# EAGLE design R3D2_main (EAGLE 5.06)
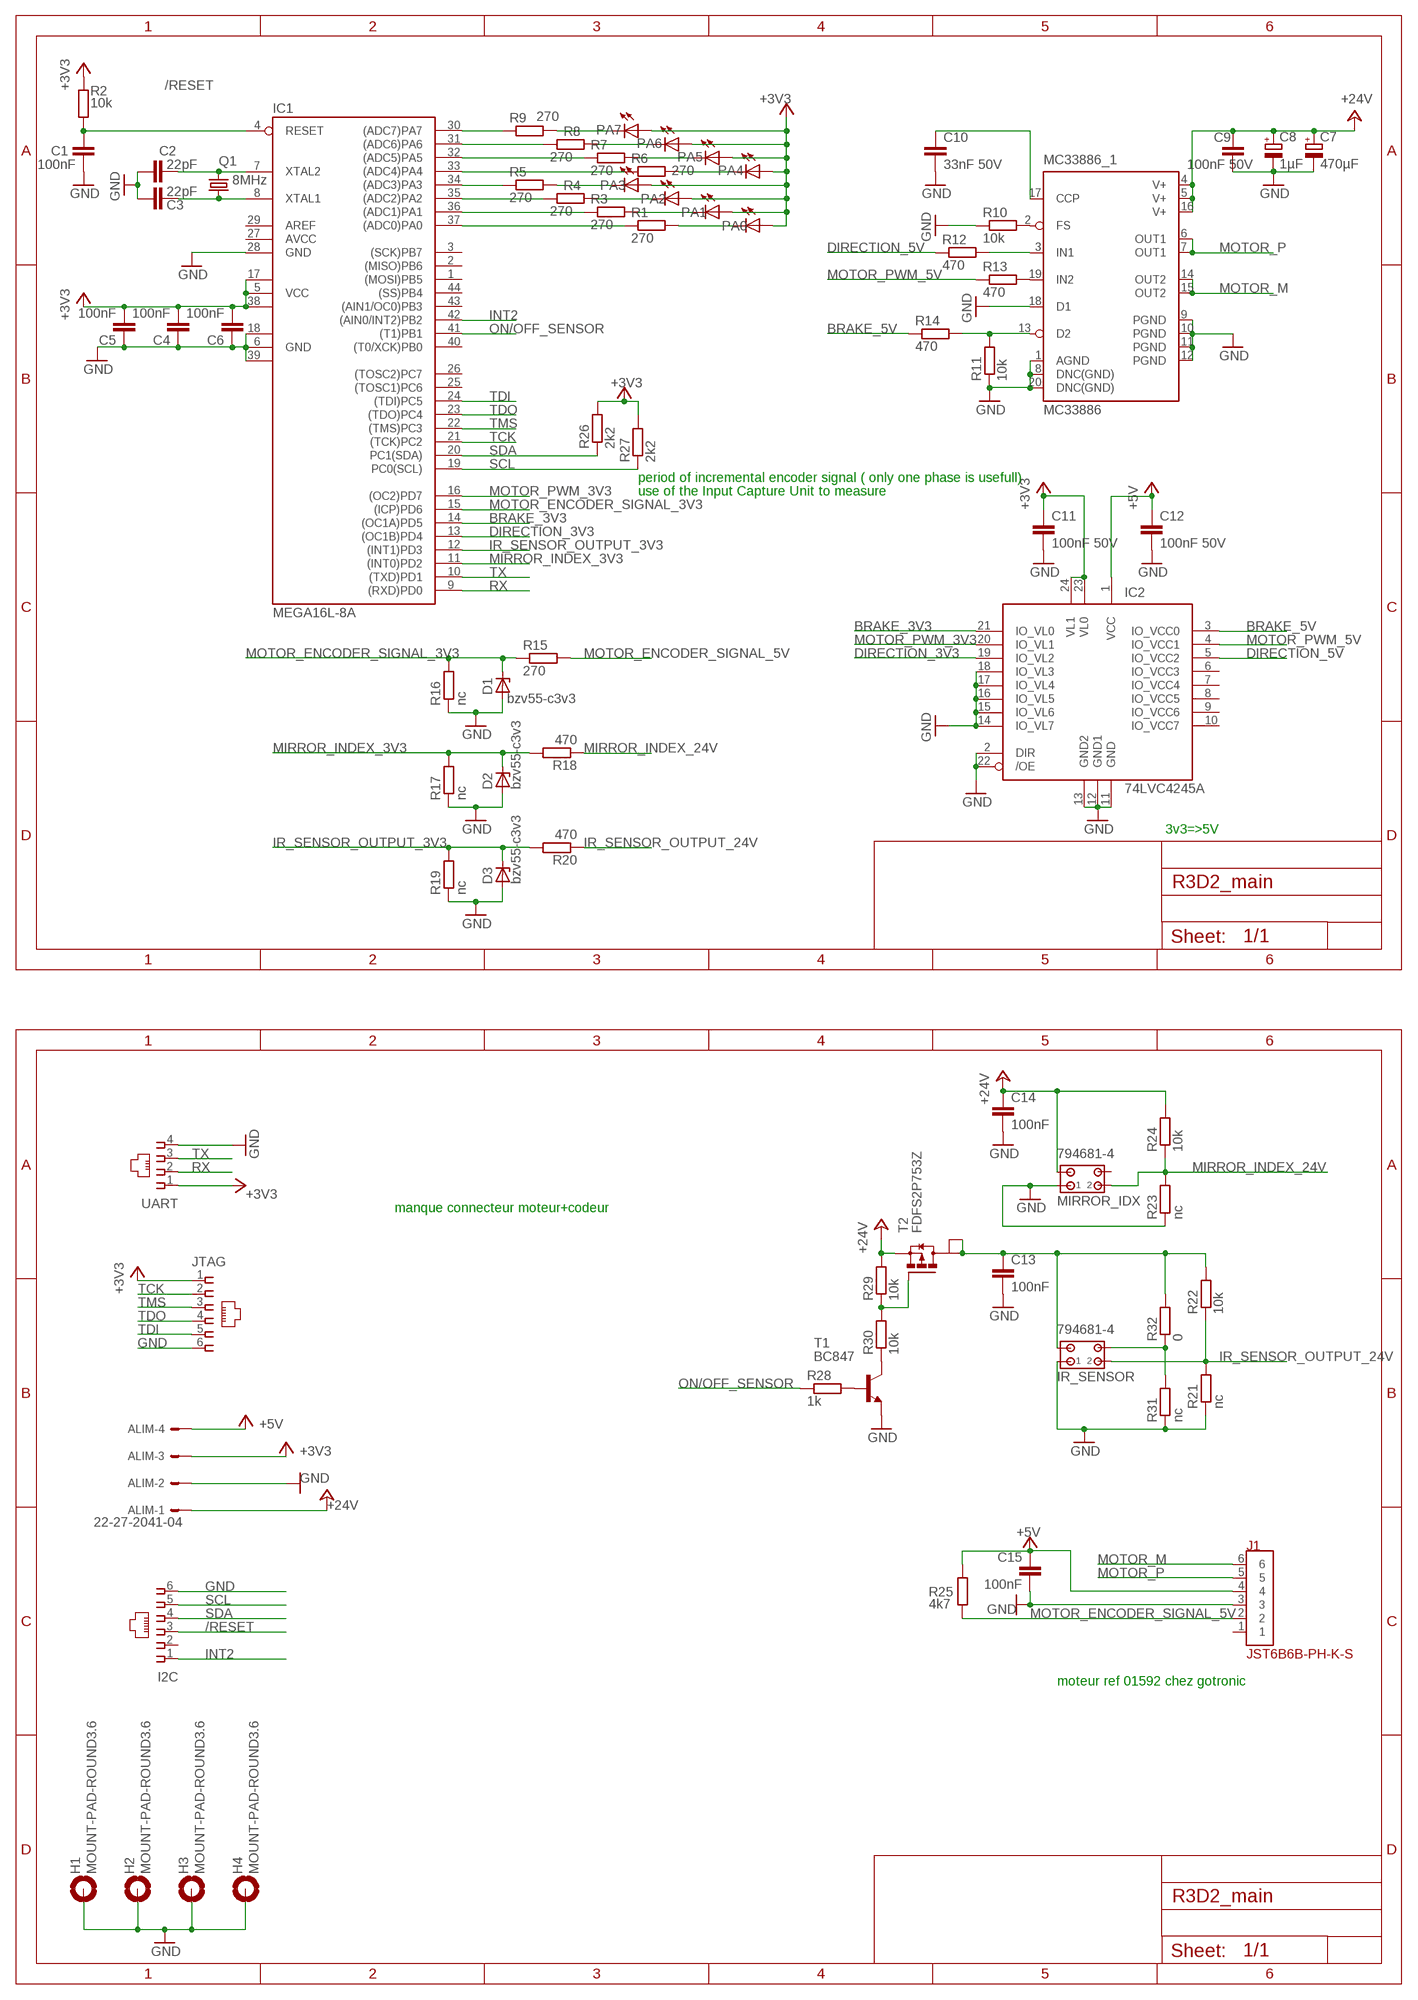
[diagram p0: schematic, sheet 1]

## Parts
ALIM  22-27-2041-04  [6410-04]
C1  100nF  C-EU050-025X075  [C050-025X075]
C2  22pF  C-EUC0805  [C0805]
C3  22pF  C-EUC0805  [C0805]
C4  100nF  C-EUC0805  [C0805]
C5  100nF  C-EUC0805  [C0805]
C6  100nF  C-EUC0805  [C0805]
C7  470µF  CPOL-EUE30-16AXIAL  [E30-16]
C8  1µF  CPOL-EUE5-5  [E5-5]
C9  100nF 50V  C-EUC0805  [C0805]
C10  33nF 50V  C-EUC0805  [C0805]
C11  100nF 50V  C-EUC0805  [C0805]
C12  100nF 50V  C-EUC0805  [C0805]
C13  100nF  C-EUC0805  [C0805]
C14  100nF  C-EUC0805  [C0805]
C15  100nF  C-EUC0805  [C0805]
D1  bzv55-c3v3  ZENER-DIODESOD80C  [SOD80C]
D2  bzv55-c3v3  ZENER-DIODESOD80C  [SOD80C]
D3  bzv55-c3v3  ZENER-DIODESOD80C  [SOD80C]
H1  MOUNT-PAD-ROUND3.6  [3,6-PAD]
H2  MOUNT-PAD-ROUND3.6  [3,6-PAD]
H3  MOUNT-PAD-ROUND3.6  [3,6-PAD]
H4  MOUNT-PAD-ROUND3.6  [3,6-PAD]
I2C  520258-3  [520258-3]
IC1  MEGA16L-8A  MEGA16-A  [TQFP44]
IC2  74LVC4245A  [TSSOP24]
IR_SENSOR  794681-4  [794681-4]
J1  JST6B6B-PH-K-S  [B6B-PH-K-S]
JTAG  520250-3  [520250-3]
MC33886_1  MC33886  [20HSOP]
MIRROR_IDX  794681-4  [794681-4]
PA0  LEDCHIP-LED0805  [CHIP-LED0805]
PA1  LEDCHIP-LED0805  [CHIP-LED0805]
PA2  LEDCHIP-LED0805  [CHIP-LED0805]
PA3  LEDCHIP-LED0805  [CHIP-LED0805]
PA4  LEDCHIP-LED0805  [CHIP-LED0805]
PA5  LEDCHIP-LED0805  [CHIP-LED0805]
PA6  LEDCHIP-LED0805  [CHIP-LED0805]
PA7  LEDCHIP-LED0805  [CHIP-LED0805]
Q1  8MHz  CRYSTALHC49S  [HC49/S]
R1  270  R-EU_R0805  [R0805]
R2  10k  R-EU_R0805  [R0805]
R3  270  R-EU_R0805  [R0805]
R4  270  R-EU_R0805  [R0805]
R5  270  R-EU_R0805  [R0805]
R6  270  R-EU_R0805  [R0805]
R7  270  R-EU_R0805  [R0805]
R8  270  R-EU_R0805  [R0805]
R9  270  R-EU_R0805  [R0805]
R10  10k  R-EU_M0805  [M0805]
R11  10k  R-EU_R0805  [R0805]
R12  470  R-EU_R0805  [R0805]
R13  470  R-EU_R0805  [R0805]
R14  470  R-EU_R0805  [R0805]
R15  270  R-EU_R0805  [R0805]
R16  nc  R-EU_R0805  [R0805]
R17  nc  R-EU_R0805  [R0805]
R18  470  R-EU_R0805  [R0805]
R19  nc  R-EU_R0805  [R0805]
R20  470  R-EU_R0805  [R0805]
R21  nc  R-EU_R0805  [R0805]
R22  10k  R-EU_R0805  [R0805]
R23  nc  R-EU_R0805  [R0805]
R24  10k  R-EU_R0805  [R0805]
R25  4k7  R-EU_R0805  [R0805]
R26  2k2  R-EU_R0805  [R0805]
R27  2k2  R-EU_R0805  [R0805]
R28  1k  R-EU_R0805  [R0805]
R29  10k  R-EU_R0805  [R0805]
R30  10k  R-EU_R0805  [R0805]
R31  nc  R-EU_R0805  [R0805]
R32  0  R-EU_R0805  [R0805]
T1  BC847  [SOT23]
T2  FDFS2P753Z  [SO8]
UART  555165-2  [555165-2]

## Nets
+3V3: ALIM.3 C4.2 C5.2 C6.2 C11.1 IC1.5(VCC) IC1.17(VCC1) IC1.38(VCC2) IC2.23(VL0) IC2.24(VL1) JTAG.1 PA0.A PA1.A PA2.A PA3.A PA4.A PA5.A PA6.A PA7.A R2.2 R26.2 R27.2 UART.1
+5V: ALIM.4 C12.1 C15.1 IC2.1(VCC) J1.4 R25.2
+24V: ALIM.1 C7.+ C8.+ C9.1 C14.1 MC33886_1.4(V+) MC33886_1.5(V+) MC33886_1.16(V+) MIRROR_IDX.3 R24.2 R29.2 T2.3(S)
/RESET: C1.1 I2C.3 IC1.4(RESET) R2.1
BRAKE_3V3: IC1.14((OC1A)PD5) IC2.21(IO_VL0)
BRAKE_5V: IC2.3(IO_VCC0) R14.1
DIRECTION_3V3: IC1.13((OC1B)PD4) IC2.19(IO_VL2)
DIRECTION_5V: IC2.5(IO_VCC2) R12.1
GND: ALIM.2 C1.2 C2.1 C3.1 C4.1 C5.1 C6.1 C7.- C8.- C9.2 C10.2 C11.2 C12.2 C13.2 C14.2 C15.2 D1.A D2.A D3.A H1.B3,6(MOUNT) H2.B3,6(MOUNT) H3.B3,6(MOUNT) H4.B3,6(MOUNT) I2C.6 IC1.6(GND) IC1.18(GND1) IC1.28(GND) IC1.39(GND2) IC2.2(DIR) IC2.11(GND) IC2.12(GND1) IC2.13(GND2) IC2.14(IO_VL7) IC2.15(IO_VL6) IC2.16(IO_VL5) IC2.17(IO_VL4) IC2.18(IO_VL3) IC2.22(/OE) IR_SENSOR.1 J1.3 JTAG.6 MC33886_1.1(AGND) MC33886_1.8(DNC(GND)) MC33886_1.9(PGND) MC33886_1.10(PGND) MC33886_1.11(PGND) MC33886_1.12(PGND) MC33886_1.18(D1) MC33886_1.20(DNC(GND)) MIRROR_IDX.1 R10.1 R11.1 R16.1 R17.1 R19.1 R21.1 R23.1 R31.1 T1.2(E) UART.4
INT2: I2C.1 IC1.42((AIN0/INT2)PB2)
IR_SENSOR_OUTPUT_3V3: D3.C IC1.12((INT1)PD3) R19.2 R20.2
IR_SENSOR_OUTPUT_24V: IR_SENSOR.2 R20.1 R21.2 R22.1
MIRROR_INDEX_3V3: D2.C IC1.11((INT0)PD2) R17.2 R18.2
MIRROR_INDEX_24V: MIRROR_IDX.2 R18.1 R23.2 R24.1
MOTOR_ENCODER_SIGNAL_3V3: D1.C IC1.15((ICP)PD6) R15.1 R16.2
MOTOR_ENCODER_SIGNAL_5V: J1.2 R15.2 R25.1
MOTOR_M: J1.6 MC33886_1.14(OUT2) MC33886_1.15(OUT2)
MOTOR_P: J1.5 MC33886_1.6(OUT1) MC33886_1.7(OUT1)
MOTOR_PWM_3V3: IC1.16((OC2)PD7) IC2.20(IO_VL1)
MOTOR_PWM_5V: IC2.4(IO_VCC1) R13.1
N$1: C2.2 IC1.7(XTAL2) Q1.2
N$2: C3.2 IC1.8(XTAL1) Q1.1
N$3: PA0.C R1.2
N$4: PA7.C R9.2
N$5: PA2.C R4.2
N$6: PA1.C R3.2
N$7: IC1.30((ADC7)PA7) R9.1
N$8: IC1.31((ADC6)PA6) R8.1
N$9: PA3.C R5.2
N$10: IC1.32((ADC5)PA5) R7.1
N$11: PA4.C R6.2
N$12: IC1.33((ADC4)PA4) R6.1
N$13: PA5.C R7.2
N$14: IC1.34((ADC3)PA3) R5.1
N$15: PA6.C R8.2
N$16: IC1.35((ADC2)PA2) R4.1
N$17: IC1.36((ADC1)PA1) R3.1
N$18: IC1.37((ADC0)PA0) R1.1
N$19: C10.1 MC33886_1.17(CCP)
N$20: C13.1 IR_SENSOR.3 R22.2 R32.2 T2.5(D) T2.6(D1)
N$21: IR_SENSOR.4 R31.2 R32.1
N$22: MC33886_1.13(D2) R11.2 R14.2
N$23: MC33886_1.19(IN2) R13.2
N$24: MC33886_1.3(IN1) R12.2
N$26: MC33886_1.2(FS) R10.2
N$27: R28.2 T1.1(B)
N$28: R30.1 T1.3(C)
N$29: R29.1 R30.2 T2.4(G)
ON/OFF_SENSOR: IC1.41((T1)PB1) R28.1
RX: IC1.9((RXD)PD0) UART.2
SCL: I2C.5 IC1.19(PC0(SCL)) R27.1
SDA: I2C.4 IC1.20(PC1(SDA)) R26.1
TCK: IC1.21((TCK)PC2) JTAG.2
TDI: IC1.24((TDI)PC5) JTAG.5
TDO: IC1.23((TDO)PC4) JTAG.4
TMS: IC1.22((TMS)PC3) JTAG.3
TX: IC1.10((TXD)PD1) UART.3
Unconnected: I2C.2 IC1.1((MOSI)PB5) IC1.2((MISO)PB6) IC1.3((SCK)PB7) IC1.25((TOSC1)PC6) IC1.26((TOSC2)PC7) IC1.29(AREF) IC1.40((T0/XCK)PB0) IC1.43((AIN1/OC0)PB3) IC1.44((SS)PB4) IC2.6(IO_VCC3) IC2.7(IO_VCC4) IC2.8(IO_VCC5) IC2.9(IO_VCC6) IC2.10(IO_VCC7) J1.1 MIRROR_IDX.4

## Notes on the sheet
- period of incremental encoder signal ( only one phase is usefull)
- use of the Input Capture Unit to measure
- 3v3=>5V
- manque connecteur moteur+codeur
- moteur ref 01592 chez gotronic

## Power pins joined to a net without a drawn wire
AVCC: IC1.27(AVCC)

## Library data of the parts
ALIM = con-molex:22-?-04: CONNECTOR wire to board 2.54 mm (.1 inch) pitch header
C1-C6 C9-C15 = rcl:C-EU: CAPACITOR, European symbol
C7 C8 = rcl:CPOL-EU: POLARIZED CAPACITOR, European symbol
D1-D3 = diode:ZENER-DIODE: Z-Diode
H1-H4 = holes:MOUNT-PAD-ROUND: MOUNTING PAD, round
I2C = con-amp:520258-3: AMP connector
IC1 = atmel:MEGA16: MICROCONTROLLER 16 Kbytes FLASH 1 kbytes SRAM 512 bytes EEPROM USART 8-channel 10 bit ADC Source: avr.lbr
IC2 = robotter:74LVC4245: octal transceiver buffer
IR_SENSOR MIRROR_IDX = con-amp:794681-4: Micro MATE-N-LOK Connectors grid 1.5mm Dual Row Through Hole Vertical Metal Through Hole Holddowns Source: ENG_CD_794681_E.pdf
J1 = robotter:JST6
JTAG = con-amp:520250-3: AMP connector
MC33886_1 = MC33886:MC33886: freescale H bridge 5A MC33886
PA0 PA1-PA7 = led:LED: LED OSRAM: - CHIPLED LG R971, LG N971, LY N971, LG Q971, LY Q971, LO R971, LY R971 LH N974, LH R974 LS Q976, LO Q976, LY Q976 LO Q996 - Hyper CHIPLED LW Q18S LB Q993, LB Q99A, LB R99A - SideLED LS A670, LO A670, LY A670, LG A670, LP A670 LB A673, LV A673, LT A673, LW A673 LH A674 LY A675 LS A676, LA A676, LO A676, LY A676, LW A676 LS A679, LY A679, LG A679 - Hyper Micro SIDELED® LS Y876, LA Y876, LO Y876, LY Y876 LT Y87S - SmartLED LW L88C, LW L88S LB L89C, LB L89S, LG L890 LS L89K, LO L89K, LY L89K LS L896, LA L896, LO L896, LY L896 - TOPLED LS T670, LO T670, LY T670, LG T670, LP T670 LSG T670, LSP T670, LSY T670, LOP T670, LYG T670 LG T671, LOG T671, LSG T671 LB T673, LV T673, LT T673, LW T673 LH T674 LS T676, LA T676, LO T676, LY T676, LB T676, LH T676, LSB T676, LW T676 LB T67C, LV T67C, LT T67C, LS T67K, LO T67K, LY T67K, LW E67C LS E67B, LA E67B, LO E67B, LY E67B, LB E67C, LV E67C, LT E67C LW T67C LS T679, LY T679, LG T679 LS T770, LO T770, LY T770, LG T770, LP T770 LB T773, LV T773, LT T773, LW T773 LH T774 LS E675, LA E675, LY E675, LS T675 LS T776, LA T776, LO T776, LY T776, LB T776 LHGB T686 LT T68C, LB T68C - Hyper Mini TOPLED® LB M676 - Mini TOPLED Santana® LG M470 LS M47K, LO M47K, LY M47K Source: http://www.osram.convergy.de LUXEON: - LUMILED® LXK2-PW12-R00, LXK2-PW12-S00, LXK2-PW14-U00, LXK2-PW14-V00 LXK2-PM12-R00, LXK2-PM12-S00, LXK2-PM14-U00 LXK2-PE12-Q00, LXK2-PE12-R00, LXK2-PE12-S00, LXK2-PE14-T00, LXK2-PE14-U00 LXK2-PB12-K00, LXK2-PB12-L00, LXK2-PB12-M00, LXK2-PB14-N00, LXK2-PB14-P00, LXK2-PB14-Q00 LXK2-PR12-L00, LXK2-PR12-M00, LXK2-PR14-Q00, LXK2-PR14-R00 LXK2-PD12-Q00, LXK2-PD12-R00, LXK2-PD12-S00 LXK2-PH12-R00, LXK2-PH12-S00 LXK2-PL12-P00, LXK2-PL12-Q00, LXK2-PL12-R00 Source: www.luxeon.com KINGBRIGHT: KA-3528ASYC Source: www.kingbright.com
Q1 = crystal:CRYSTAL: CRYSTAL
R1-R32 = rcl:R-EU_: RESISTOR, European symbol
T1 = transistor:BC847: NPN TRANSISTOR
T2 = robotter:FDFS2P753Z
UART = con-amp:555165-2: AMP connector

## Board
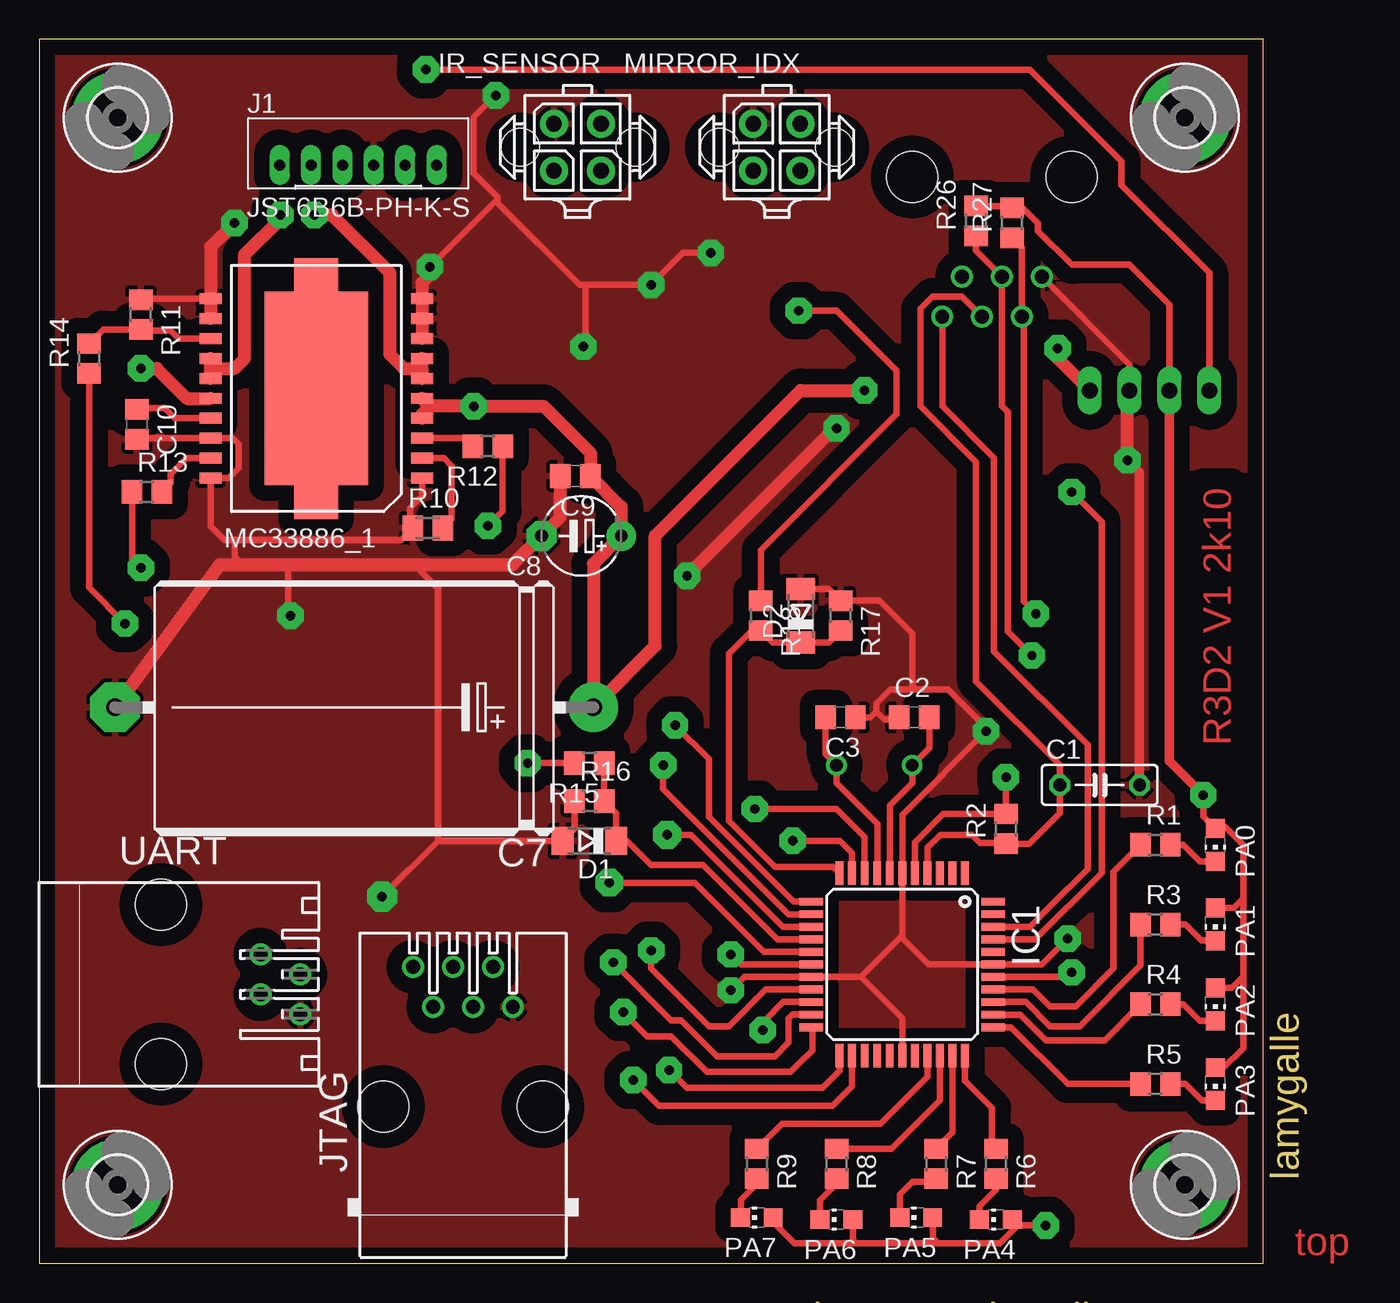
[diagram p1: board, top side]
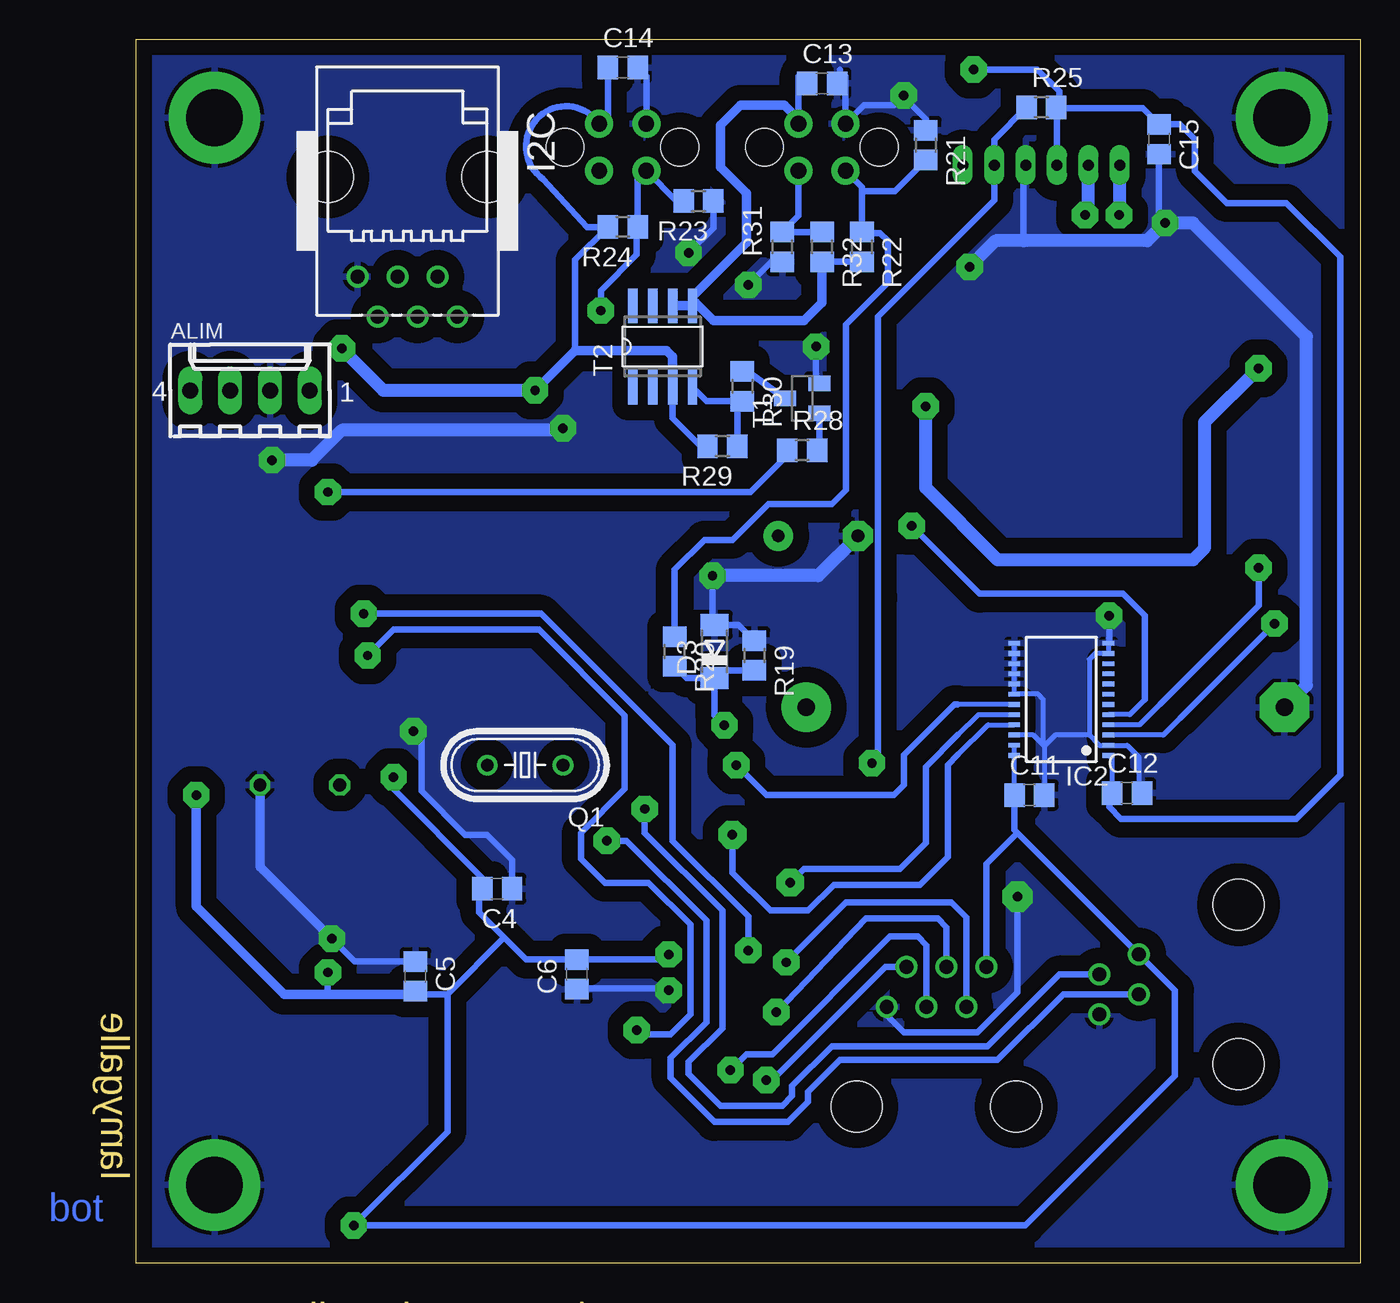
[diagram p2: board, bottom side, seen from below]

Size 78 x 78 mm. Coordinates in mm from the lower left corner, seen from the top.
Outline: 0,0 78,0 78,78 0,78 0,0
Copper layers (1*16): Top 0.035mm / dielectric 1.5mm / Bottom 0.035mm
Design rules "default *": minimum track width 0.3mm, minimum drill 0.4mm, track to track 1mm, track to pad 1mm, pad to pad 1mm, via to via 0.3mm, smd to smd 8mil, copper to edge 1mm, drill to drill 8mil, minimum pad ring 10mil, minimum via ring 8mil, stop-mask expansion 4mil, vias tented up to drill 0mil, thermal gap 10mil

### Footprints (pad centres in the part's own frame; a part is rotated, then mirrored left to right if it is on the bottom)
6410-04 = drill 1.016 long: 1 3.81,0; 2 1.27,0; 3 -1.27,0; 4 -3.81,0
C050-025X075 = drill 0.813 octagon: 1 -2.54,0; 2 2.54,0
C0805 = smd 1.3 x 1.5: 1 -0.95,0; 2 0.95,0
E30-16 = drill 1.118 pad 3.15 round: + -15.24,0 | drill 1.118 pad 3.15 octagon: - 15.24,0
E5-5 = drill 0.813 pad 1.905 round: + -2.54,0 | drill 0.813 pad 1.905 octagon: - 2.54,0
SOD80C = smd 1.4 x 1.8: A 1.7,0; C -1.7,0
3,6-PAD = drill 3.6 pad 5.842 round: B3,6 0,0
520258-3 = drill 0.889 round: 1 -3.175,8.001; 2 -1.905,5.461; 3 -0.635,8.001; 4 0.635,5.461; 5 1.905,8.001; 6 3.175,5.461 | hole 3.251: -5.08,-0.889; 5.08,-0.889
TQFP44 = smd 1.5 x 0.5: 1 -5.8,4; 2 -5.8,3.2; 3 -5.8,2.4; 4 -5.8,1.6; 5 -5.8,0.8; 6 -5.8,0; 7 -5.8,-0.8; 8 -5.8,-1.6; 9 -5.8,-2.4; 10 -5.8,-3.2; 11 -5.8,-4; 23 5.8,-4; 24 5.8,-3.2; 25 5.8,-2.4; 26 5.8,-1.6; 27 5.8,-0.8; 28 5.8,0; 29 5.8,0.8; 30 5.8,1.6; 31 5.8,2.4; 32 5.8,3.2; 33 5.8,4 | smd 0.5 x 1.5: 12 -4,-5.8; 13 -3.2,-5.8; 14 -2.4,-5.8; 15 -1.6,-5.8; 16 -0.8,-5.8; 17 0,-5.8; 18 0.8,-5.8; 19 1.6,-5.8; 20 2.4,-5.8; 21 3.2,-5.8; 22 4,-5.8; 34 4,5.8; 35 3.2,5.8; 36 2.4,5.8; 37 1.6,5.8; 38 0.8,5.8; 39 0,5.8; 40 -0.8,5.8; 41 -1.6,5.8; 42 -2.4,5.8; 43 -3.2,5.8; 44 -4,5.8
TSSOP24 = smd 0.3 x 0.75: 1 -3.575,-3; 2 -2.925,-3; 3 -2.275,-3; 4 -1.625,-3; 5 -0.975,-3; 6 -0.325,-3; 7 0.325,-3; 8 0.975,-3; 9 1.625,-3; 10 2.275,-3; 11 2.925,-3; 12 3.575,-3; 13 3.575,3; 14 2.925,3; 15 2.275,3; 16 1.625,3; 17 0.975,3; 18 0.325,3; 19 -0.325,3; 20 -0.975,3; 21 -1.625,3; 22 -2.275,3; 23 -2.925,3; 24 -3.575,3
794681-4 = drill 1 pad 1.778 round: 1 1.5,-1.5; 2 1.5,1.5; 3 -1.5,-1.5; 4 -1.5,1.5 | hole 2.4: 3.63,0; -3.67,0
B6B-PH-K-S = drill 0.7 pad 1.27 long: 1 5,0; 2 3,0; 3 1,0; 4 -1,0; 5 -3,0; 6 -5,0
520250-3 = drill 0.889 round: 1 -3.175,8.89; 2 -1.905,6.35; 3 -0.635,8.89; 4 0.635,6.35; 5 1.905,8.89; 6 3.175,6.35 | hole 3.251: -5.08,0; 5.08,0
20HSOP = smd 0.7 x 1.4: 1 -5.715,-6.731; 2 -4.445,-6.731; 3 -3.175,-6.731; 4 -1.905,-6.731; 5 -0.635,-6.731; 6 0.635,-6.731; 7 1.905,-6.731; 8 3.175,-6.731; 9 4.445,-6.731; 10 5.715,-6.731; 11 5.715,6.731; 12 4.445,6.731; 13 3.175,6.731; 14 1.905,6.731; 15 0.635,6.731; 16 -0.635,6.731; 17 -1.905,6.731; 18 -3.175,6.731; 19 -4.445,6.731; 20 -5.715,6.731 | smd 12.35 x 6.6: SL1 0,0 | smd 2.15 x 2.8: SL2 -7.239,0; SL3 7.239,0
CHIP-LED0805 = smd 1.2 x 1.2: A 0,-1.05; C 0,1.05
HC49/S = drill 0.813 round: 1 -2.413,0; 2 2.413,0
R0805 = smd 1.3 x 1.5: 1 -0.95,0; 2 0.95,0
M0805 = smd 1.3 x 1.6: 1 -0.95,0; 2 0.95,0
SOT23 = smd 1 x 1.4: 1 -0.95,-1.1; 2 0.95,-1.1; 3 0,1.1
SO8 = smd 0.6 x 2.2: 1 -1.905,-2.6; 2 -0.635,-2.6; 3 0.635,-2.6; 4 1.905,-2.6; 5 1.905,2.6; 6 0.635,2.6; 7 -0.635,2.6; 8 -1.905,2.6
555165-2 = drill 0.889 round: 1 -1.905,5.207; 2 -0.635,7.747; 3 0.635,5.207; 4 1.905,7.747 | hole 3.251: -5.08,-1.143; 5.08,-1.143

### Placement (x,y rotation side)
ALIM  70.74,55.63 0 bottom
C1  67.56,30.48 0 top
C2  55.75,34.8 0 top
C3  51.05,34.8 180 top
C4  54.99,23.88 180 bottom
C5  60.2,18.29 270 bottom
C6  49.91,18.41 90 bottom
C7  20.07,35.43 180 top
C8  34.54,46.35 180 top
C9  34.16,50.16 180 top
C10  6.22,53.47 270 top
C11  21.08,29.84 0 bottom
C12  14.86,29.97 0 bottom
C13  34.29,75.18 0 bottom
C14  46.99,76.2 0 bottom
C15  12.83,71.63 270 bottom
D1  35.05,26.92 180 top
D2  48.51,41.27 90 top
D3  41.15,38.99 90 bottom
H1  73,5 0 top
H2  73,73 0 top
H3  5,73 0 top
H4  5,5 0 top
I2C  60.71,68.33 180 bottom
IC1  54.99,19.05 270 top
IC2  19.05,35.94 90 bottom
IR_SENSOR  34.29,71.12 180 top
J1  20.32,69.98 0 top
JTAG  27,10 0 top
MC33886_1  17.65,55.75 90 top
MIRROR_IDX  46.99,71.12 180 top
PA0  74.93,26.67 180 top
PA1  74.93,21.59 180 top
PA2  74.93,16.51 180 top
PA3  74.93,11.43 180 top
PA4  60.96,2.79 90 top
PA5  55.88,2.92 90 top
PA6  50.8,2.79 90 top
PA7  45.72,2.92 90 top
Q1  53.21,31.75 180 bottom
R1  71.12,26.67 0 top
R2  61.59,27.69 90 top
R3  71.12,21.59 0 top
R4  71.12,16.51 0 top
R5  71.12,11.43 0 top
R6  60.96,6.35 270 top
R7  57.15,6.35 270 top
R8  50.8,6.35 270 top
R9  45.72,6.35 270 top
R10  24.77,46.86 0 top
R11  6.48,60.45 270 top
R12  28.57,52.07 180 top
R13  6.86,49.15 0 top
R14  3.17,57.66 90 top
R15  35.05,31.88 180 top
R16  35.05,29.46 0 top
R17  51.05,41.27 270 top
R18  45.97,41.27 270 top
R19  38.61,38.73 270 bottom
R20  43.69,38.99 270 bottom
R21  27.69,71.25 270 bottom
R22  31.75,64.77 270 bottom
R23  42.16,67.69 180 bottom
R24  46.99,66.04 180 bottom
R25  20.32,73.66 0 bottom
R26  59.69,66.42 90 top
R27  61.98,66.29 90 top
R28  35.56,51.82 0 bottom
R29  40.64,52.07 180 bottom
R30  39.37,55.88 270 bottom
R31  36.83,64.77 90 bottom
R32  34.29,64.77 270 bottom
T1  35.56,55.12 90 bottom
T2  44.45,58.42 0 bottom
UART  8.89,17.78 270 top

### Tracks (layer width: path | path; a pad name or v marks a point on that pad's centre or on a via)
+3V3  (via drill 0.6 pad 1.68)
  Top 0.406: IC1.38 65.49,18.25 v65.79,18.54 | v64.14,2.41 62.36,2.41 | 62.36,2.41 62.14,2.41 PA4.A | ALIM.3 72.01,61.09 69.47,63.63 65.79,63.63 63.63,65.79 63.63,66.29 62.61,67.31 62.04,67.31 R27.2 62.36,67.37 R26.2 | v61.59,30.99 R2.2 57.59,28.64 55.79,26.84 IC1.5 | PA7.A 46.77,2.63 48.13,1.27 52.07,1.27 | 57.28,1.27 61.21,1.27 62.36,2.41 | 57.28,1.27 52.07,1.27 | PA5.A 56.93,1.62 57.28,1.27 | PA6.A 51.85,1.49 52.07,1.27 | 76.71,23.24 76.71,18.29 | 76.71,18.29 76.71,13.72 75.44,12.45 74.96,12.45 PA3.A | PA2.A 75.98,17.56 76.71,18.29 | PA1.A 76.11,22.64 76.71,23.24 | v74.17,29.84 74.17,28.48 PA0.A 75.02,27.81 75.56,27.81 76.71,26.67 76.71,23.24 | IC1.17 44.7,19.05 v44.07,19.68
  Top 0.61: v74.17,29.84 72.01,32 ALIM.3
  Bottom 0.305: IC2.23 IC2.24 22.05,30.37 C11.1
  Bottom 0.406: 54.55,20.77 53.15,19.36 C6.2 44.39,19.36 v44.07,19.68 | 54.55,20.77 56.13,22.35 56.13,23.68 C4.2 55.94,24.57 61.59,30.23 v61.59,30.99 | 58.17,17.14 60.39,17.14 | 58.17,17.14 54.55,20.77 | v65.79,18.54 65.79,17.27 65.66,17.14 | 58.17,17.14 58.17,8.38 v64.14,2.41 21.34,2.41 11.81,11.94 11.81,17.4 UART.1 21.84,27.43 | 21.84,27.43 22.03,27.62 C11.1 | JTAG.1 23.82,25.45 21.84,27.43
  Bottom 0.61: C5.2 60.39,17.14 65.66,17.14 68.58,17.14 74.17,22.73 v74.17,29.84
+5V  (via drill 0.6 pad 1.68)
  Top 0.406: ALIM.4 74.55,63.12 68.96,68.71 68.96,70.23 63.12,76.07 61.72,76.07 | v24.64,76.07 61.72,76.07 | 61.72,76.07 62.74,76.07
  Bottom 0.305: C12.1 15.81,32.12 IC2.1
  Bottom 0.406: 19.32,73.61 R25.2 19.18,73.85 19.18,74.68 20.57,76.07 v24.64,76.07 | 19.32,73.61 13.86,73.61 C15.1 11.49,72.58 10.54,71.63 10.54,69.6 8.51,67.56 4.7,67.56 1.27,64.14 1.27,63.25 | 1.27,31.5 1.27,31.37 | 1.27,31.5 1.27,63.25 | 1.27,63.25 1.27,63.63 | C12.1 16,29.78 16,29.08 15.24,28.32 4.06,28.32 1.27,31.11 1.27,31.5 | 19.32,73.61 J1.4
+24V  (via drill 0.6 pad 1.68)
  Top 0.813: 24.89,54.61 MC33886_1.5 | 24.89,54.61 v27.69,54.61 32.13,54.61 35.11,51.63 C9.1 37.08,48.19 C8.+ 35.31,44.58 C7.+ 39.24,39.37 39.24,46.35 48.51,55.63 v52.58,55.63 | 24.89,54.61 24.38,54.1 MC33886_1.4 | MC33886_1.16 9.4,55.12 7.49,57.02 v6.48,57.02 | v64.9,58.29 64.9,57.66 ALIM.1
  Bottom 0.406: C14.1 47.94,73.17 MIRROR_IDX.3 arc-200 52.07,69.09 49.28,66.04 R24.2 50.04,63.94 50.04,58.17 | R29.2 42.04,52.07 43.81,53.85 T2.3
  Bottom 0.61: T2.3 43.81,57.78 44.2,58.17 50.04,58.17 v52.58,55.63
  Bottom 0.813: v6.48,57.02 9.91,53.59 9.91,45.59 10.67,44.83 23.11,44.83 27.69,49.4 v27.69,54.61 | v52.58,55.63 62.23,55.63 v64.9,58.29
/RESET
  Top 0.406: C1.1 64.83,30.23 | I2C.3 58.8,61.59 56.9,61.59 56.13,60.83 56.13,54.61 59.69,51.05 59.69,37.08 65.02,31.75 C1.1 | C1.1 65.02,28.7 63.06,26.74 R2.1 61.53,26.8 59.94,26.8 59.44,27.3 57.4,27.3 56.59,26.49 IC1.4
BRAKE_3V3  (via drill 0.6 pad 1.78)
  Top 0.406: IC1.14 47.38,21.45 41.85,26.99 | 41.85,26.99 41.66,27.18 | v40.01,27.3 41.53,27.3 41.85,26.99
  Bottom 0.305: IC2.21 23.72,34.32 25.65,32.38
  Bottom 0.406: 25.65,32.38 26.29,31.75 26.29,25.91 28.07,24.13 33.53,24.13 35.18,22.48 37.59,22.48 40.01,24.89 v40.01,27.3
BRAKE_5V  (via drill 0.6 pad 1.68)
  Top 0.406: R14.1 3.17,43.05 v5.46,40.77
  Bottom 0.305: IC2.3 12.56,33.67 11.43,34.8
  Bottom 0.406: 11.43,34.8 v5.46,40.77
DIRECTION_3V3  (via drill 0.6 pad 1.68)
  Top 0.406: IC1.13 47.73,22.25 39.75,30.23 v39.75,31.75
  Bottom 0.305: IC2.19 25.65,35.62
  Bottom 0.406: 25.65,35.62 25.85,35.62 29.08,32.38 29.08,30.48 29.72,29.84 37.85,29.84 v39.75,31.75
DIRECTION_5V  (via drill 0.6 pad 1.68)
  Top 0.406: R12.1 29.52,47.94 v28.57,46.99
  Bottom 0.305: IC2.5 14.69,34.97 13.72,35.94
  Bottom 0.406: v28.57,46.99 24.26,42.67 15.11,42.67 13.72,41.27 13.72,35.94
GND  (via drill 0.6 pad 1.68, 0.6 pad 1.93)
  Top 0.406: 55.88,36.58 57.91,36.58 60.33,34.16 v60.33,33.91 54.99,28.57 IC1.6 54.99,20.88 54.9,20.79 | 55.88,36.58 54.23,36.58 53.34,35.69 53.34,35.18 | 53.34,35.18 53.85,34.67 54.68,34.67 C2.1 | C3.1 52.96,34.8 53.34,35.18 | MC33886_1.11 6.54,61.47 R11.1 | C10.2 6.28,52.58 MC33886_1.18 12.32,52.58 12.7,52.2 12.7,50.67 12.06,50.04 MC33886_1.20 10.92,46.99 11.81,46.1 12.45,46.1 | 52.36,18.25 IC1.18 44.92,18.25 v44.07,17.4 | D2.A 50.3,42.98 R17.1 53.53,42.23 55.63,40.13 55.63,36.83 55.88,36.58 | v65.53,20.7 63.88,19.05 IC1.39 56.64,19.05 54.9,20.79 | ALIM.2 69.47,57.28 I2C.6 | MC33886_1.1 24.38,48.9 23.62,48.13 23.62,47.06 R10.1 23.05,46.1 12.45,46.1 | 12.95,44.52 12.45,45.02 12.45,46.1 | v16,41.27 15.88,41.4 15.88,44.52 | v24.89,63.5 29.08,67.69 29.15,67.63 | 29.15,67.63 34.42,62.36 34.8,62.36 | 34.8,62.36 v38.99,62.36 40.51,63.88 | v34.67,58.42 34.8,58.04 34.8,62.36 | v29.08,74.42 27.69,73.03 27.69,69.47 29.21,67.94 29.21,67.69 29.15,67.63 | 40.51,63.88 40.77,64.14 | v42.8,64.39 41.02,64.39 40.51,63.88 | R16.1 34.1,27.67 D1.A 25.4,26.92 | 54.9,20.79 52.36,18.25 | 52.36,18.25 54.99,15.62 IC1.28 | 25.4,26.92 v21.84,23.37 | 25.4,26.92 25.4,42.99 23.88,44.52
  Top 0.61: C1.2 70.1,50.42 v69.34,51.18
  Top 0.813: MC33886_1.8 MC33886_1.9 MC33886_1.10 24.38,62.48 25.15,63.25 v24.89,63.5 | MC33886_1.12 MC33886_1.11 10.92,64.77 v12.45,66.29 | 15.62,44.52 12.95,44.52 11.5,44.52 C7.- | 15.62,44.52 15.88,44.52 | v69.34,51.18 69.34,55.5 ALIM.2 | v50.8,53.21 50.67,53.21 v41.27,43.81 | 23.88,44.52 24.06,44.52 | 15.62,44.52 23.88,44.52 | 23.88,44.52 30.16,44.52 C8.- 33.21,47.56 C9.2
  Bottom 0.305: C12.2 14.1,30.67 14.1,32.26 14.86,33.02 IC2.2 16.63,33.02 17.27,33.66 | IC2.12 IC2.11 16.89,38.86 17.27,38.48 17.27,33.66 | 20.13,32.96 C11.2 | 20.13,32.96 20.26,33.08 | 20.26,33.08 20.83,33.66 22.04,33.66 IC2.22 | IC2.13 IC2.14 IC2.15 IC2.16 IC2.17 IC2.18 20.52,36.27 20.19,35.94 20.19,33.15 20.26,33.08 | 17.27,33.66 19.44,33.66 20.13,32.96
  Bottom 0.406: C15.2 12.83,66.67 v12.45,66.29 | 21.46,65.15 21.46,69.71 | C14.2 45.49,75.65 MIRROR_IDX.1 | 49.85,17.53 C6.1 | 49.85,17.53 48.13,17.53 | C5.1 64.07,19.24 v65.53,20.7 | IC2.12 16,39.56 v16,41.27 | 33.15,76.07 33.15,75.63 C13.2 32.79,75.65 IR_SENSOR.1 31.62,73.79 29.72,73.79 29.21,74.3 | v29.08,74.42 29.21,74.3 | v38.99,62.36 37.53,63.82 R31.1 | T1.2 34.67,56.28 v34.67,58.42 | 29.21,74.3 29.08,74.3 27.69,72.9 R21.1 | v42.8,64.39 41.21,65.97 R23.1 | C4.1 54.04,25.72 55.63,27.3 57.02,27.3 59.82,30.1 59.82,33.4 v60.33,33.91 | 49.85,17.53 44.7,17.53 v44.07,17.4 | R19.1 39.61,40.69 D3.A 41.27,40.69 v41.27,43.81 | JTAG.6 30.18,15.82 29.08,14.73 24.38,14.73 21.84,17.27 v21.84,23.37
  Bottom 0.61: v65.53,20.7 70.1,25.27 C1.2
  Bottom 0.813: v24.89,63.5 23.24,65.15 21.46,65.15 13.59,65.15 v12.45,66.29 10.67,66.29 3.43,59.05 3.43,36.83 C7.- | v50.8,53.21 50.93,53.09 64.9,53.09 66.8,51.18 v69.34,51.18 | v41.27,43.81 34.54,43.81 C8.-
  pour Top: 0,78.11 77.98,78.11 77.98,0 0,0
  pour Bottom: 0,-0.13 77.98,-0.13 77.98,77.85 0,77.85
INT2
  Top 0.406: IC1.42 63.11,21.45 64.39,22.73 | 64.39,22.73 64.64,22.99 | 64.39,22.73 66.8,25.15 66.8,33.02 60.83,38.99 60.83,51.31 57.53,54.61 I2C.1
IR_SENSOR_OUTPUT_3V3  (via drill 0.6 pad 1.68)
  Top 0.406: IC1.12 48.07,23.05 42.67,28.45 42.67,32.13 v40.51,34.29
  Bottom 0.406: R19.2 40.65,37.78 D3.C | D3.C 41.15,34.92 v40.51,34.29 | R20.2 42.94,37.29 D3.C
IR_SENSOR_OUTPUT_24V
  Bottom 0.406: IR_SENSOR.2 31.75,68.58 31.75,68.33 | 31.75,68.33 R22.1 31.69,65.66 30.61,65.66 30.1,65.15 30.1,62.48 32.77,59.82 32.77,49.28 33.66,48.39 37.72,48.39 40.01,46.1 41.78,46.1 43.69,44.2 43.69,41.91 R20.1 | R21.2 29.66,68.33 31.75,68.33
MIRROR_INDEX_3V3
  Top 0.406: R17.2 50.3,39.58 D2.C 46.72,39.58 R18.2 45.41,40.33 43.94,38.86 43.94,28.19 46.86,25.27 50.57,25.27 IC1.11
MIRROR_INDEX_24V  (via drill 0.6 pad 1.68)
  Top 0.406: R18.1 45.97,45.47 54.61,54.1 54.61,56.9 50.8,60.71 v48.39,60.71
  Bottom 0.406: v48.39,60.71 48.39,61.98 46.1,64.26 46.1,65.98 R24.1 46.04,69.07 MIRROR_IDX.2 43.56,67.69 R23.2
MOTOR_ENCODER_SIGNAL_3V3
  Top 0.406: R15.1 R16.2 36.75,28.71 D1.C 37.47,26.92 38.99,25.4 42.29,25.4 47.04,20.65 IC1.15
MOTOR_ENCODER_SIGNAL_5V  (via drill 0.6 pad 1.68)
  Top 0.406: v31.11,31.88 R15.2
  Bottom 0.406: R25.1 23.32,71.61 J1.2 23.32,67.74 30.73,60.33 30.73,42.67 | 30.73,42.67 30.73,42.16 | 30.73,42.67 30.73,32.26 v31.11,31.88
MOTOR_M  (via drill 0.6 pad 1.68)
  Top 0.813: MC33886_1.15 10.92,57.02 | 10.92,57.02 MC33886_1.14 | 10.92,57.02 12.45,57.02 13.08,57.66 13.08,64.26 15.37,66.55 v15.37,66.8
  Bottom 0.813: v15.37,66.8 15.32,66.85 J1.6
MOTOR_P  (via drill 0.6 pad 1.68)
  Top 0.813: 24.38,57.02 MC33886_1.7 | 24.38,57.02 MC33886_1.6 | 24.38,57.02 23.24,57.02 22.35,57.91 22.35,63.12 18.67,66.8 v17.53,66.8
  Bottom 0.813: v17.53,66.8 17.32,67.01 J1.5
MOTOR_PWM_3V3  (via drill 0.6 pad 1.78)
  Top 0.406: v36.32,24.26 41.78,24.26 46.19,19.85 IC1.16
  Bottom 0.305: IC2.20 24.34,34.97 25.65,33.66
  Bottom 0.406: 25.65,33.66 27.69,31.62 27.69,26.8 29.34,25.15 35.43,25.15 v36.32,24.26
MOTOR_PWM_5V  (via drill 0.6 pad 1.68)
  Top 0.406: R13.1 5.91,44.89 v6.48,44.32
  Bottom 0.305: IC2.4 14.07,34.32 12.7,35.69
  Bottom 0.406: 12.7,35.69 6.48,41.91 v6.48,44.32
N$1
  Top 0.406: C2.2 56.7,32.83 Q1.2 55.63,30.61 54.19,29.17 IC1.7
N$2
  Top 0.406: C3.2 50.1,32.45 Q1.1 50.8,30.61 53.39,28.02 IC1.8
N$3
  Top 0.406: PA0.C 73.95,25.62 72.9,26.67 R1.2
N$4
  Top 0.406: R9.2 45.72,5.08 44.7,4.06 44.7,2.57 PA7.C
N$5
  Top 0.406: PA2.C 73.95,15.46 72.9,16.51 R4.2
N$6
  Top 0.406: R3.2 73.03,21.59 74.04,20.57 74.9,20.57 PA1.C
N$7
  Top 0.406: R9.1 47.31,8.89 53.59,8.89 56.59,11.89 IC1.30
N$8
  Top 0.406: R8.1 51.69,7.3 | 51.69,7.3 52.89,7.3 | IC1.31 57.39,10.4 54.29,7.3 51.69,7.3
N$9
  Top 0.406: PA3.C 74.08,10.38 73.03,11.43 R5.2
N$10
  Top 0.406: IC1.32 58.19,8.34 R7.1
N$11
  Top 0.406: PA4.C 59.91,3.65 60.96,4.7 R6.2
N$12
  Top 0.406: R6.1 60.71,7.55 60.71,9.91 58.99,11.62 IC1.33
N$13
  Top 0.406: PA5.C 54.83,4.41 55.63,5.21 56.96,5.21 R7.2
N$14
  Top 0.406: IC1.34 61.91,15.05 65.53,11.43 R5.1
N$15
  Top 0.406: R8.2 50.8,5.08 49.75,4.03 PA6.C
N$16
  Top 0.406: IC1.35 62.51,15.85 64.14,14.22 67.88,14.22 R4.1
N$17
  Top 0.406: 69.85,21.59 R3.1 70.17,18.99 66.29,15.11 64.39,15.11 62.85,16.65 IC1.36
N$18
  Top 0.406: R1.1 68.45,24.95 68.45,18.8 66.04,16.38 64.39,16.38 63.32,17.45 IC1.37
N$19
  Top 0.406: MC33886_1.17 8.64,53.85 8,54.48 6.29,54.48 C10.1
N$20
  Bottom 0.406: IR_SENSOR.3 35.79,75.65 C13.1 | R32.2 R22.2
  Bottom 0.61: T2.5 T2.6 | T2.5 42.35,61.21 41.21,60.07 35.43,60.07 34.29,61.21 R32.2 | T2.5 42.55,61.59 39.12,65.02 39.12,68.2 40.77,69.85 40.77,72.52 39.5,73.79 36.7,73.79 35.79,72.87 IR_SENSOR.3
N$21
  Bottom 0.406: R32.1 R31.2 35.79,66.76 IR_SENSOR.4
N$22
  Top 0.406: MC33886_1.13 8.89,58.93 8.38,59.44 6.54,59.44 R11.2 4.07,59.5 R14.2
N$23
  Top 0.406: MC33886_1.19 9.4,51.31 8.38,50.29 8.38,49.72 R13.2
N$24
  Top 0.406: MC33886_1.3 27.12,52.58 R12.2
N$26
  Top 0.406: R10.2 26.29,47.44 26.29,50.8 25.78,51.31 MC33886_1.2
N$27
  Bottom 0.406: R28.2 34.46,51.97 T1.1
N$28
  Bottom 0.406: T1.3 39.22,56.98 R30.1
N$29
  Bottom 0.406: R29.1 39.69,54.61 R30.2 41.66,54.93 T2.4
ON/OFF_SENSOR  (via drill 0.6 pad 1.68)
  Top 0.406: IC1.41 63.45,20.65 67.69,24.89 67.69,47.24 v65.79,49.15
  Bottom 0.406: R28.1 36.51,51.5 38.86,49.15 v65.79,49.15
RX  (via drill 0.6 pad 1.68)
  Top 0.406: v45.59,28.96 50.8,28.96 52.59,27.16 IC1.9
  Bottom 0.406: UART.2 19.18,18.41 23.75,13.84 33.66,13.84 36.2,11.3 36.2,10.67 36.83,10.03 40.77,10.03 42.8,12.06 42.8,12.83 40.64,14.99 40.64,22.48 45.59,27.43 v45.59,28.96
SCL  (via drill 0.6 pad 1.68)
  Top 0.406: IC1.19 46.28,17.45 43.94,15.11 42.67,15.11 38.99,18.8 v38.99,19.94 38.99,19.81 | v63.5,41.4 62.74,42.16 62.74,60.2 I2C.5 62.61,64.71 R27.1
  Bottom 0.406: v63.5,41.4 52.2,41.4 43.81,33.02 43.81,26.92 38.99,22.1 v38.99,19.94
SDA  (via drill 0.6 pad 1.68)
  Top 0.406: 46.23,14.99 v46.1,14.86 46.23,14.86 46.23,15.49 47.38,16.65 IC1.20 | R26.1 59.69,64.52 I2C.4 61.34,54.61 61.72,54.23 61.72,40.26 v63.25,38.73
  Bottom 0.406: v63.25,38.73 61.59,40.39 52.32,40.39 46.86,34.92 46.86,30.23 49.66,27.43 49.66,25.78 48.13,24.26 45.34,24.26 42.67,21.59 42.67,15.88 43.94,14.61 45.34,14.61 v46.1,14.86
TCK  (via drill 0.6 pad 1.68)
  Top 0.406: IC1.21 49.17,15.88 48.01,15.88 47.75,15.62 47.75,14.1 46.86,13.21 43.18,13.21 40.89,15.49 40.26,15.49 v36.58,19.18
  Bottom 0.406: JTAG.2 25.09,22.05 26.04,22.99 32.77,22.99 v36.58,19.18
TDI  (via drill 0.6 pad 1.68)
  Top 0.406: IC1.24 51.79,11.28 50.55,10.03 39.5,10.03 v37.85,11.68
  Bottom 0.406: v37.85,11.68 37.97,11.68 | v37.85,11.68 37.34,11.68 | JTAG.5 30.26,18.89 37.47,11.68 v37.85,11.68
TDO  (via drill 0.6 pad 1.68)
  Top 0.406: IC1.23 50.99,12.26 49.91,11.18 41.27,11.18 v40.13,12.32
  Bottom 0.406: JTAG.4 27.64,20.27 28.19,20.83 29.97,20.83 37.47,13.34 39.12,13.34 v40.13,12.32
TMS  (via drill 0.6 pad 1.68)
  Top 0.406: IC1.22 49.28,14.96 49.28,13.59 48.39,12.7 47.88,12.19 42.55,12.19 40.26,14.48 38.73,14.48 v37.21,16
  Bottom 0.406: JTAG.3 26.36,21.41 26.92,21.97 31.5,21.97 v37.21,16
TX  (via drill 0.6 pad 1.68)
  Top 0.406: v48.01,26.92 51.03,26.92 51.79,26.16 IC1.10
  Bottom 0.406: UART.3 18.92,17.14 23.11,12.95 33.15,12.95 35.18,10.92 35.18,10.29 36.45,9.02 41.15,9.02 43.94,11.81 43.94,13.08 41.66,15.37 41.66,21.84 46.74,26.92 v48.01,26.92

### Text on the board
Top: R3D2 V1 2k10 | top
Bottom: bot
Dimension: lamygalle | un calque pour les aligner tous